# Altium schematic sheet SHDN-CURRENT-S11-V00-7SegmentDisplay.SchDoc: 7 Segment Display (0.56")
size A3; DrawnBy: Jonn Dillon; DocumentNumber: 11; SheetNumber: 11; SheetTotal: 14; Project: Shutdown Current Board 2020
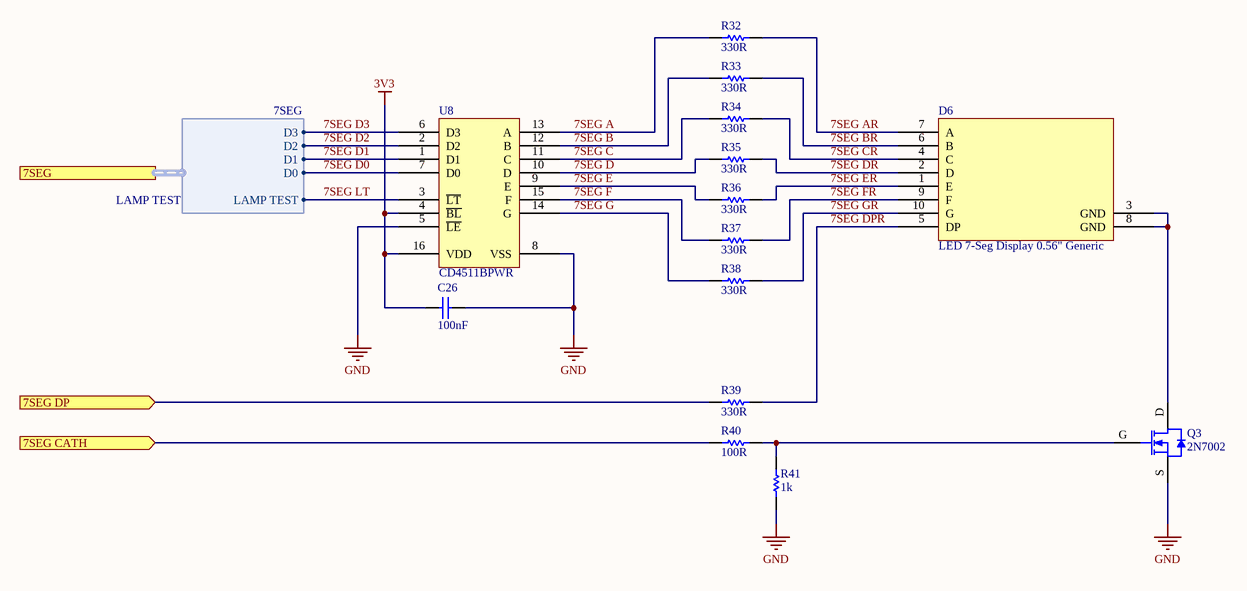
[diagram p0: SHDN-CURRENT-S11-V00-7SegmentDisplay.SchDoc]

## Parts
C26  100nF  [Cap_Ceramic_0603]
D6  LED 7-Seg Display 0.56" Generic  [LED 7 SEG 0.56"]
Q3  2N7002  [SOT23-3]
R32  330R  [Res_ThinFilm_0603]
R33  330R  [Res_ThinFilm_0603]
R34  330R  [Res_ThinFilm_0603]
R35  330R  [Res_ThinFilm_0603]
R36  330R  [Res_ThinFilm_0603]
R37  330R  [Res_ThinFilm_0603]
R38  330R  [Res_ThinFilm_0603]
R39  330R  [Res_ThinFilm_0603]
R40  100R  [Res_ThinFilm_0603]
R41  1k  [Res_ThinFilm_0603]
U8  CD4511BPWR  [16-TSSOP]

## Ports
7SEG (harness 7SEG), 7SEG CATH (in), 7SEG DP (in)

## Harnesses
7SEG: D3, D2, D1, D0, LAMP TEST

## Nets
3V3: C26.1 U8.4(~{BL}) U8.16(VDD)
GND: C26.2 Q3.S R41.1 U8.5(~{LE}) U8.8(VSS)
7SEG A: R32.1 U8.13(A)
7SEG AR: D6.7(A) R32.2
7SEG B: R33.1 U8.12(B)
7SEG BR: D6.6(B) R33.2
7SEG C: R34.1 U8.11(C)
7SEG CATH: R40.1 ; port 7SEG CATH
7SEG CR: D6.4(C) R34.2
7SEG D: R35.1 U8.10(D)
7SEG D0: U8.7(D0) ; port 7SEG.D0
7SEG D1: U8.1(D1) ; port 7SEG.D1
7SEG D2: U8.2(D2) ; port 7SEG.D2
7SEG D3: U8.6(D3) ; port 7SEG.D3
7SEG DP: R39.1 ; port 7SEG DP
7SEG DPR: D6.5(DP) R39.2
7SEG DR: D6.2(D) R35.2
7SEG E: R36.1 U8.9(E)
7SEG ER: D6.1(E) R36.2
7SEG F: R37.1 U8.15(F)
7SEG FR: D6.9(F) R37.2
7SEG G: R38.1 U8.14(G)
7SEG GR: D6.10(G) R38.2
7SEG LT: U8.3(~{LT}) ; port 7SEG.LAMP TEST
NetD6_3: D6.3(GND) D6.8(GND) Q3.D
NetQ3_G: Q3.G R40.2 R41.2

## Notes on the sheet
- LAMP TEST
- Revision History:
- Sheet Title:
- Rev
- Date
- Description
- Project:
- Size:
- Drawn By:
- A3
- Number:
- Revision:
- Sheet
- Version:
- of
- QUT Motorsport
- O-120, Gardens Point
- 2 George Street
- Brisbane, QLD 4000
- Australia
- Print Date:
- Print Time:
- File Name:

## Library data of the parts
C26 = 100nF 50V 5% X7R 0603: Capacitor, Ceramic, SMD, 100nF, 50V, 5%, X7R, 0603
D6 = LED 7-Seg Display 0.56"
R32-R39 = 330R 5% 0603: Resistor, SMD, 330R, 0.1W, 5%, 0603
R40 = 100R 5%, 0603: Resistor, SMD, 100R, 0.1W, 5%, 0603
R41 = 1k 5% 0603: Resistor, SMD, 1k, 0.1W, 5%, 0603
U8 = CD4511BPWR: LED Driver 7 Segment 16-TSSOP